# Altium schematic sheet ZYNQ_PW.SchDoc: SqueakyBoard
size A
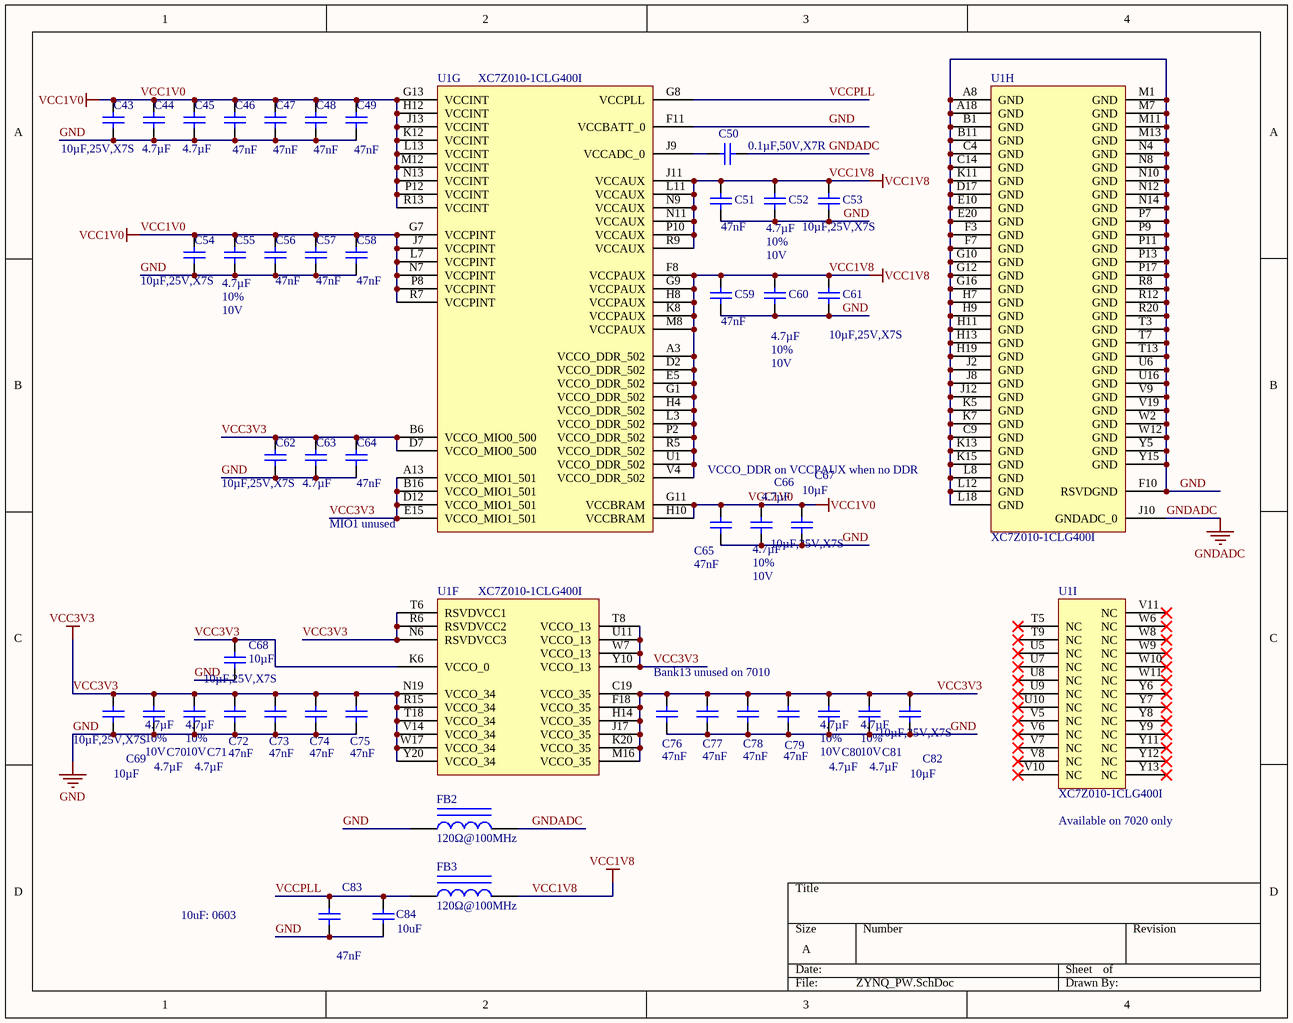
[diagram p0: ZYNQ_PW.SchDoc]

## Parts
C43  value 10µF,25V,X7S  [CAP0805i]  (hidden comment: 10µF)
C44  4.7µF  [CAP0402i]
C45  4.7µF  [CAP0402i]
C46  Capacitance: 47nF  [CAP0201i]
C47  Capacitance: 47nF  [CAP0201i]
C48  Capacitance: 47nF  [CAP0201i]
C49  Capacitance: 47nF  [CAP0201i]
C50  value 0.1µF,50V,X7R  [CAP0402i]  (hidden comment: 0.1µF)
C51  Capacitance: 47nF  [CAP0201i]
C52  Tolerance: 10%  Voltage Rating: 10V  [CAP0402i]  (hidden comment: 4.7µF)
C53  value 10µF,25V,X7S  [CAP0805i]  (hidden comment: 10µF)
C54  value 10µF,25V,X7S  [CAP0805i]  (hidden comment: 10µF)
C55  Tolerance: 10%  Voltage Rating: 10V  [CAP0402i]  (hidden comment: 4.7µF)
C56  Capacitance: 47nF  [CAP0201i]
C57  Capacitance: 47nF  [CAP0201i]
C58  Capacitance: 47nF  [CAP0201i]
C59  Capacitance: 47nF  [CAP0201i]
C60  Tolerance: 10%  Voltage Rating: 10V  [CAP0402i]  (hidden comment: 4.7µF)
C61  value 10µF,25V,X7S  [CAP0805i]  (hidden comment: 10µF)
C62  value 10µF,25V,X7S  [CAP0805i]  (hidden comment: 10µF)
C63  4.7µF  [CAP0402i]
C64  Capacitance: 47nF  [CAP0201i]
C65  Capacitance: 47nF  [CAP0201i]
C66  4.7µF  Tolerance: 10%  Voltage Rating: 10V  [CAP0402i]
C67  10µF  value 10µF,25V,X7S  [CAP0805i]
C68  10µF  value 10µF,25V,X7S  [CAP0805i]
C69  10µF  value 10µF,25V,X7S  [CAP0805i]
C70  4.7µF  Tolerance: 10%  Voltage Rating: 10V  [CAP0402i]
C71  4.7µF  Tolerance: 10%  Voltage Rating: 10V  [CAP0402i]
C72  Capacitance: 47nF  [CAP0201i]
C73  Capacitance: 47nF  [CAP0201i]
C74  Capacitance: 47nF  [CAP0201i]
C75  Capacitance: 47nF  [CAP0201i]
C76  Capacitance: 47nF  [CAP0201i]
C77  Capacitance: 47nF  [CAP0201i]
C78  Capacitance: 47nF  [CAP0201i]
C79  Capacitance: 47nF  [CAP0201i]
C80  4.7µF  Tolerance: 10%  Voltage Rating: 10V  [CAP0402i]
C81  4.7µF  Tolerance: 10%  Voltage Rating: 10V  [CAP0402i]
C82  10µF  value 10µF,25V,X7S  [CAP0805i]
C83  Capacitance: 47nF  [CAP0201i]
C84  10uF  [0603_C]
FB2  120Ω@100MHz  [0805_L]
FB3  120Ω@100MHz  [0805_L]
U1  XC7Z010-1CLG400I  [CLG400]  (parts F,G,H,I of 9)

## Nets
GND: C43.2 C44.2 C45.2 C46.2 C47.2 C48.2 C49.2 C51.1 C52.1 C53.1 C54.2 C55.2 C56.2 C57.2 C58.2 C59.1 C60.1 C61.1 C62.2 C63.2 C64.2 C65.1 C66.1 C67.1 C68.1 C69.2 C70.2 C71.2 C72.2 C73.2 C74.2 C75.2 C76.2 C77.2 C78.2 C79.2 C80.2 C81.2 C82.2 C83.1 C84.1 FB2.1 U1.A8(GND) U1.A18(GND) U1.B1(GND) U1.B11(GND) U1.C4(GND) U1.C9(GND) U1.C14(GND) U1.D17(GND) U1.E10(GND) U1.E20(GND) U1.F3(GND) U1.F7(GND) U1.F10(RSVDGND) U1.F11(VCCBATT_0) U1.G10(GND) U1.G12(GND) U1.G16(GND) U1.H7(GND) U1.H9(GND) U1.H11(GND) U1.H13(GND) U1.H19(GND) U1.J2(GND) U1.J8(GND) U1.J12(GND) U1.K5(GND) U1.K7(GND) U1.K11(GND) U1.K13(GND) U1.K15(GND) U1.L8(GND) U1.L12(GND) U1.L18(GND) U1.M1(GND) U1.M7(GND) U1.M11(GND) U1.M13(GND) U1.N4(GND) U1.N8(GND) U1.N10(GND) U1.N12(GND) U1.N14(GND) U1.P7(GND) U1.P9(GND) U1.P11(GND) U1.P13(GND) U1.P17(GND) U1.R8(GND) U1.R12(GND) U1.R20(GND) U1.T3(GND) U1.T7(GND) U1.T13(GND) U1.U6(GND) U1.U16(GND) U1.V9(GND) U1.V19(GND) U1.W2(GND) U1.W12(GND) U1.Y5(GND) U1.Y15(GND)
GNDADC: C50.2 FB2.2 U1.J10(GNDADC_0)
VCC1V0: C43.1 C44.1 C45.1 C46.1 C47.1 C48.1 C49.1 C54.1 C55.1 C56.1 C57.1 C58.1 C65.2 C66.2 C67.2 U1.G7(VCCPINT) U1.G11(VCCBRAM) U1.G13(VCCINT) U1.H10(VCCBRAM) U1.H12(VCCINT) U1.J7(VCCPINT) U1.J13(VCCINT) U1.K12(VCCINT) U1.L7(VCCPINT) U1.L13(VCCINT) U1.M12(VCCINT) U1.N7(VCCPINT) U1.N13(VCCINT) U1.P8(VCCPINT) U1.P12(VCCINT) U1.R7(VCCPINT) U1.R13(VCCINT)
VCC1V8: C51.2 C52.2 C53.2 C59.2 C60.2 C61.2 FB3.2 U1.A3(VCCO_DDR_502) U1.D2(VCCO_DDR_502) U1.E5(VCCO_DDR_502) U1.F8(VCCPAUX) U1.G1(VCCO_DDR_502) U1.G9(VCCPAUX) U1.H4(VCCO_DDR_502) U1.H8(VCCPAUX) U1.J11(VCCAUX) U1.K8(VCCPAUX) U1.L3(VCCO_DDR_502) U1.L11(VCCAUX) U1.M8(VCCPAUX) U1.N9(VCCAUX) U1.N11(VCCAUX) U1.P2(VCCO_DDR_502) U1.P10(VCCAUX) U1.R5(VCCO_DDR_502) U1.R9(VCCAUX) U1.U1(VCCO_DDR_502) U1.V4(VCCO_DDR_502)
VCC3V3: C62.1 C63.1 C64.1 C68.2 C69.1 C70.1 C71.1 C72.1 C73.1 C74.1 C75.1 C76.1 C77.1 C78.1 C79.1 C80.1 C81.1 C82.1 U1.A13(VCCO_MIO1_501) U1.B6(VCCO_MIO0_500) U1.B16(VCCO_MIO1_501) U1.C19(VCCO_35) U1.D7(VCCO_MIO0_500) U1.D12(VCCO_MIO1_501) U1.E15(VCCO_MIO1_501) U1.F18(VCCO_35) U1.H14(VCCO_35) U1.J17(VCCO_35) U1.K6(VCCO_0) U1.K20(VCCO_35) U1.M16(VCCO_35) U1.N6(RSVDVCC3) U1.N19(VCCO_34) U1.R6(RSVDVCC2) U1.R15(VCCO_34) U1.T6(RSVDVCC1) U1.T8(VCCO_13) U1.T18(VCCO_34) U1.U11(VCCO_13) U1.V14(VCCO_34) U1.W7(VCCO_13) U1.W17(VCCO_34) U1.Y10(VCCO_13) U1.Y20(VCCO_34)
VCCPLL: C83.2 C84.2 FB3.1 U1.G8(VCCPLL)
NetC50_1: C50.1 U1.J9(VCCADC_0)

Not connected (* = marked no-connect by the designer): U1 T5(NC)* T9(NC)* U5(NC)* U7(NC)* U8(NC)* U9(NC)* U10(NC)* V5(NC)* V6(NC)* V7(NC)* V8(NC)* V10(NC)* V11(NC)* W6(NC)* W8(NC)* W9(NC)* W10(NC)* W11(NC)* Y6(NC)* Y7(NC)* Y8(NC)* Y9(NC)* Y11(NC)* Y12(NC)* Y13(NC)*

## Notes on the sheet
- VCCO_DDR on VCCPAUX when no DDR
- MIO1 unused
- Bank13 unused on 7010
- (near U1) Available on 7020 only
- 10uF: 0603
- Title
- Size:
- Date:
- A
- Number:
- Time:
- Revision:
- Sheet
- of
- File:

## Library data of the parts
C43 C53 C54 C61 C62 C67-C69 C82 = Cap_10uF_50V_X7S_0805: 0805, 10uF, 10%, 25V, X7S; Part Number: GRT21BC71E106KE13L; Manufacturer 1: Murata; Type: Ceramic; Package: 0805 (2012 Metric); Voltage: 25V; Temperature Coefficient: X7S; Tolerance: ±10%; Operating Temperature: -55°C ~ 125°C; Mounting Type: SMT; Applications: Automotive; Ratings: AEC-Q200; Supplier 1: Mouser; Supplier Part Number 1: 81-GRT21BC71E106KE13; Manufacturer Part Number: GRT21BC71E106KE13L; Component Type: Generic; Capacitance: 10µF; Note: *; Supplier Part Number 2: 490-GRT21BC71E106KE13LCT-ND; Supplier Part Number 3: 3784584; Supplier 2: DigiKey; Supplier 3: Farnell; Manufacturer Part Number 1: GRT21BC71E106KE13L
C44 C45 C63 = Cap_4.7uF_10V_10%_0402: CAP CER 4.7UF 10V X5R 0402; Part Number: C1005X5R1A475K050BC; Manufacturer 1: TDK; Dielectric Material: Ceramic; Value: 4.7µF, 10V, X5R; Tolerance: 10%; ComponentLink1Description: https://datasheet.ciiva.com/14895/tdkmlcccaprange-14895671.pdf?src-supplier=Digi-Key; ComponentLink1URL: https://datasheet.ciiva.com/14895/tdkmlcccaprange-14895671.pdf?src-supplier=Digi-Key; Supplier 1: Mouser; Manufacturer Part Number 1: C1005X5R1A475K050BC; RoHS: Yes; Category: Ceramic Capacitors; Stock 1: 1272492; Mount: Surface Mount; Case/Package: 0402; Case Code (Metric): 1005; Case Code (Imperial): 0402; Min Operating Temperature: -55°C; Max Operating Temperature: 85°C; Package Quantity: 10000; Packaging: Cut Tape; Voltage Rating (DC): 10V; Series: C; Dielectric: X5R; Length: 0.039inch; Width: 0.02inch; Thickness: 0.022inch; Lead Free: Lead Free; RoHS Compliant: Yes; Reach SVHC Compliant: Yes; ComponentLink2URL: https://datasheet.ciiva.com/14895/tdkmlcccaprange-14895670.pdf?src-supplier=Digi-Key; ComponentLink2Description: https://datasheet.ciiva.com/14895/tdkmlcccaprange-14895670.pdf?src-supplier=Digi-Key; ComponentLink3URL: https://datasheet.ciiva.com/14895/tdkmlcccaprange-14895672.pdf?src-supplier=Digi-Key; ComponentLink3Description: https://datasheet.ciiva.com/14895/tdkmlcccaprange-14895672.pdf?src-supplier=Digi-Key; Supplier Part Number 1: 810-C1005X5R1A475KBC; Component Type: Generic; Capacitance: 4.7µF; Voltage Rating: 10V
C46-C49 C51 C56-C59 C64 C65 C72-C79 C83 = Cap_47nF_X7R_0201: 0201, 47nF, 10%, 25V, X7R; Value: 47nF, 0201 X7R; Package: 0201; Mounting Type: SMT; Applications: Automotive; Ratings: AEC-Q200; Component Type: Generic; Note: *; Supplier 1: Arrow Electronics; Supplier 2: Future Electronics; Supplier 3: Farnell; Supplier 4: Mouser; Supplier 5: Digikey; Supplier 6: Newark; Supplier Part Number 1: GRM033R61A473KE84D; Supplier Part Number 2: 4125905; Supplier Part Number 3: 3340765; Supplier Part Number 4: 81-GRM033R61A473KE4D; Supplier Part Number 5: 490-14570-1-ND; Supplier Part Number 6: 77AH4496
C50 = Cap_0.1uF_50V_X7R_0402: 0402, 0.1uF, 10%,  50V, X7R; Part Number: C1005X7R1H104K050BE; Manufacturer 1: TDK; Type: Ceramic; Voltage: 50V; Temperature Coefficient: X7R; Tolerance: ±10%; Operating Temperature: -55°C ~ 125°C; Mounting Type: SMT; Package: 0402 (1005 Metric); Applications: Automotive; Ratings: AEC-Q200; Supplier 1: Mouser; Supplier Part Number 1: 810-C1005X7R1H104KBE; Manufacturer Part Number 1: C1005X7R1H104K050BE; Component Type: Generic; Capacitance: 0.1µF; Note: *; Supplier 2: DigiKey; Supplier 3: Farnell; Supplier Part Number 2: 445-173610-1-ND; Supplier Part Number 3: 3416071
C52 C55 C60 C66 C70 C71 C80 C81 = Cap_4.7uF_10V_10%_0402: CAP CER 4.7UF 10V X5R 0402; Part Number: C1005X5R1A475K050BC; Manufacturer 1: TDK; Dielectric Material: Ceramic; Value: 4.7µF, 10V, X5R; ComponentLink1Description: https://datasheet.ciiva.com/14895/tdkmlcccaprange-14895671.pdf?src-supplier=Digi-Key; ComponentLink1URL: https://datasheet.ciiva.com/14895/tdkmlcccaprange-14895671.pdf?src-supplier=Digi-Key; Supplier 1: Mouser; Manufacturer Part Number 1: C1005X5R1A475K050BC; RoHS: Yes; Category: Ceramic Capacitors; Stock 1: 1272492; Mount: Surface Mount; Case/Package: 0402; Case Code (Metric): 1005; Case Code (Imperial): 0402; Min Operating Temperature: -55°C; Max Operating Temperature: 85°C; Package Quantity: 10000; Packaging: Cut Tape; Voltage Rating (DC): 10V; Series: C; Dielectric: X5R; Length: 0.039inch; Width: 0.02inch; Thickness: 0.022inch; Lead Free: Lead Free; RoHS Compliant: Yes; Reach SVHC Compliant: Yes; ComponentLink2URL: https://datasheet.ciiva.com/14895/tdkmlcccaprange-14895670.pdf?src-supplier=Digi-Key; ComponentLink2Description: https://datasheet.ciiva.com/14895/tdkmlcccaprange-14895670.pdf?src-supplier=Digi-Key; ComponentLink3URL: https://datasheet.ciiva.com/14895/tdkmlcccaprange-14895672.pdf?src-supplier=Digi-Key; ComponentLink3Description: https://datasheet.ciiva.com/14895/tdkmlcccaprange-14895672.pdf?src-supplier=Digi-Key; Supplier Part Number 1: 810-C1005X5R1A475KBC; Component Type: Generic; Capacitance: 4.7µF
C84 = 0603 10uF (106) 10% 10V: 贴片电容; ComponentLink1Description: 供应商链接; ComponentLink1URL: http://www.szlcsc.com/product/details_20411.html; Package: 0603; Supplier: LC; SuppliersPartNumber: C19702
FB2 FB3 = 0805 600Ω 25% 100MHz: 贴片磁珠; ComponentLink1Description: 供应商链接; ComponentLink1URL: http://www.szlcsc.com/product/details_1369.html; Package: 0805; Supplier: LC; SuppliersPartNumber: C1017
U1 = XC7Z010-1CLG400I: 667 MHz Zynq?7000 AP SoC, 130 PS I/O, 100 FPGA I/O, 400-Ball BGA, Speed Grade 1, Industrial Grade, Pb-Free; Manufacturer: Xilinx; Extensible Block RAM (# 36Kb Blocks): 240 KB (60); Flip Flops: 35200; LUTs: 17600; Speed Grade: -1; DatasheetVersion: v1.2; PackageVersion: Rev 1.1; PackageReference: CLG400; PackageDescription: Wire-Bond Chip-Scale BGA, Body 17 x 17 mm, 0.8 mm Pitch; Generic Part Number: XC7Z010; RoHS: Pb-Free; Mounting Technology: Surface Mount; Code_JEDEC: MO-275-MMAA-1; PartNumber: XC7Z010-1CLG400I; ComponentLink1Description: Datasheet; ComponentLink1URL: http://www.xilinx.com/support/documentation/data_sheets/ds190-Zynq-7000-Overview.pdf; ComponentLink2Description: Package Specification; ComponentLink2URL: http://www.xilinx.com/support/documentation/user_guides/ug865-Zynq-7000-Pkg-Pinout.pdf; ComponentLink3Description: DC and AC Switching Characteristics; ComponentLink3URL: http://www.xilinx.com/support/documentation/data_sheets/ds187-XC7Z010-XC7Z020-Data-Sheet.pdf; ComponentLink4Description: Package File; ComponentLink4URL: http://www.xilinx.com/support/packagefiles/z7packages/xc7z010clg400pkg.txt; ComponentLink5Description: Packaging and Pinout; ComponentLink5URL: http://www.xilinx.com/support/documentation/user_guides/ug865-Zynq-7000-Pkg-Pinout.pdf; ComponentLink6Description: PCB and Layout Guide; ComponentLink6URL: http://www.xilinx.com/support/documentation/user_guides/ug483_7Series_PCB.pdf